# EAGLE design year-led-r1 (EAGLE 6.5.0)
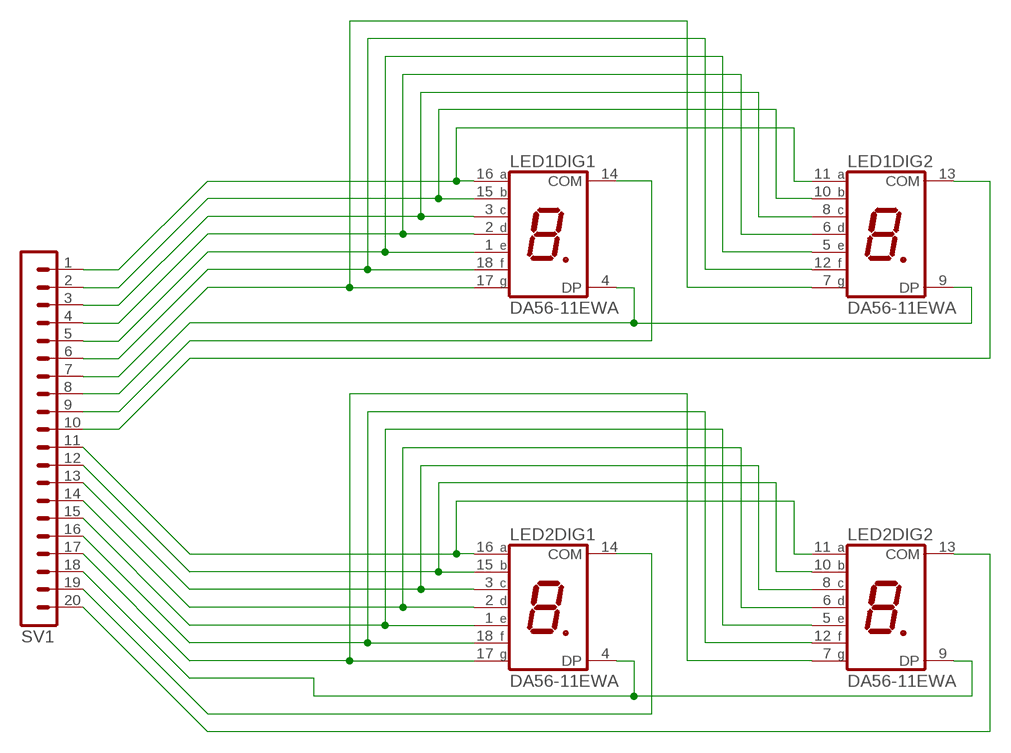
[diagram p0: schematic, sheet 1]

## Parts
LED1  DA56-11EWA  [DA56]
LED2  DA56-11EWA  [DA56]
SV1  MA20-1W  [MA20-1W]

## Nets
N$1: LED1.11(DIG2:A) LED1.16(DIG1:A) SV1.1
N$2: LED1.10(DIG2:B) LED1.15(DIG1:B) SV1.2
N$3: LED1.3(DIG1:C) LED1.8(DIG2:C) SV1.3
N$4: LED1.2(DIG1:D) LED1.6(DIG2:D) SV1.4
N$5: LED1.1(DIG1:E) LED1.5(DIG2:E) SV1.5
N$6: LED1.12(DIG2:F) LED1.18(DIG1:F) SV1.6
N$7: LED1.7(DIG2:G) LED1.17(DIG1:G) SV1.7
N$8: LED1.4(DIG1:DP) LED1.9(DIG2:DP) SV1.8
N$9: LED2.11(DIG2:A) LED2.16(DIG1:A) SV1.11
N$10: LED2.10(DIG2:B) LED2.15(DIG1:B) SV1.12
N$11: LED2.3(DIG1:C) LED2.8(DIG2:C) SV1.13
N$12: LED2.2(DIG1:D) LED2.6(DIG2:D) SV1.14
N$13: LED2.1(DIG1:E) LED2.5(DIG2:E) SV1.15
N$14: LED2.12(DIG2:F) LED2.18(DIG1:F) SV1.16
N$15: LED2.7(DIG2:G) LED2.17(DIG1:G) SV1.17
N$16: LED2.4(DIG1:DP) LED2.9(DIG2:DP) SV1.18
N$17: LED1.13(DIG2:COM) SV1.10
N$20: LED1.14(DIG1:COM) SV1.9
N$26: LED2.14(DIG1:COM) SV1.19
N$27: LED2.13(DIG2:COM) SV1.20

## Library data of the parts
LED1 LED2 = display-kingbright:DA56-11: 14.22mm (0.56INCH) DUAL DIGIT NUMERIC DISPLAYS Source: www.kingbright.com .. DA56-11SRWA.pdf; OC_FARNELL: unknown; OC_NEWARK: unknown
SV1 = con-lstb:MA20-1W: PIN HEADER; OC_FARNELL: unknown; OC_NEWARK: unknown

## Board
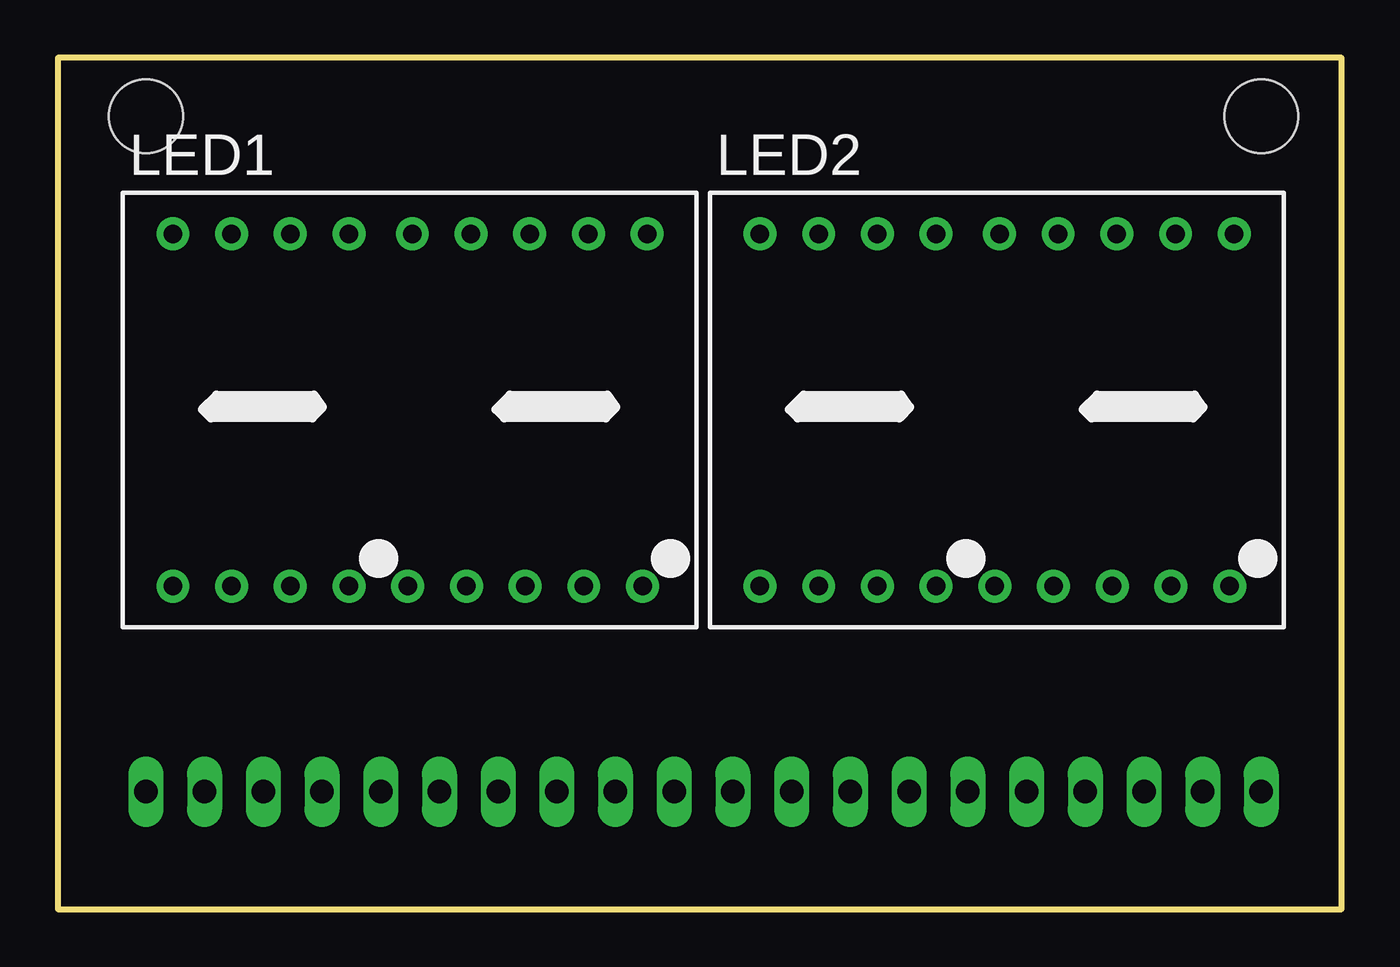
[diagram p1: board, top side]
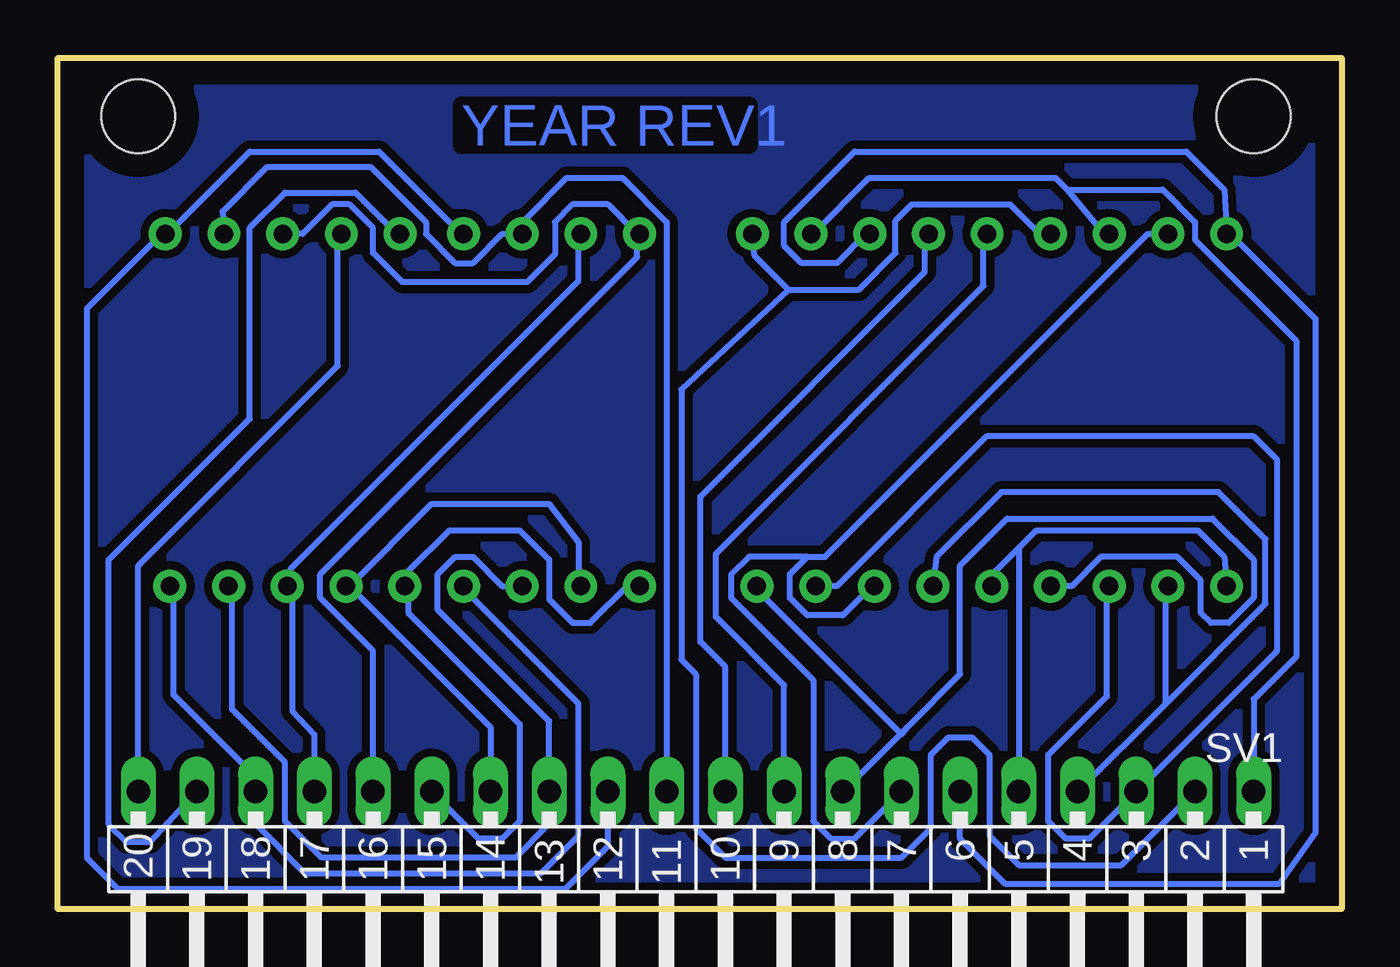
[diagram p2: board, bottom side, seen from below]

Size 55.55 x 36.82 mm. Coordinates in mm from the lower left corner, seen from the top.
Outline: 0,0 55.55,0 55.55,36.82 0,36.82 0,0
Copper layers (1*16): Top 0.035mm / dielectric 1.5mm / Bottom 0.035mm
Design rules "default *": minimum track width 10mil, minimum drill 24mil, track to track 14mil, track to pad 14mil, pad to pad 14mil, via to via 14mil, smd to smd 14mil, copper to edge 40mil, drill to drill 8mil, minimum pad ring 10mil, minimum via ring 8mil, stop-mask expansion 4mil, vias tented up to drill 0mil, thermal gap 10mil
Holes 3.2 mm at 3.81,34.29 52.07,34.29

### Footprints (pad centres in the part's own frame; a part is rotated, then mirrored left to right if it is on the bottom)
DA56 = drill 0.8 pad 1.422: 1 -10.26,-7.62; 2 -7.72,-7.62; 3 -5.18,-7.62; 4 -2.64,-7.62; 5 -0.1,-7.62; 6 2.44,-7.62; 7 4.98,-7.62; 8 7.52,-7.62; 9 10.06,-7.62; 10 10.26,7.62; 11 7.72,7.62; 12 5.18,7.62; 13 2.64,7.62; 14 0.1,7.62; 15 -2.64,7.62; 16 -5.18,7.62; 17 -7.72,7.62; 18 -10.26,7.62
MA20-1W = drill 1.016 long: 1 -24.13,0; 2 -21.59,0; 3 -19.05,0; 4 -16.51,0; 5 -13.97,0; 6 -11.43,0; 7 -8.89,0; 8 -6.35,0; 9 -3.81,0; 10 -1.27,0; 11 1.27,0; 12 3.81,0; 13 6.35,0; 14 8.89,0; 15 11.43,0; 16 13.97,0; 17 16.51,0; 18 19.05,0; 19 21.59,0; 20 24.13,0

### Placement (x,y rotation side)
LED1  15.24,21.59 0 top
LED2  40.64,21.59 0 top
SV1  27.94,5.08 180 bottom

### Tracks (layer width: path | path; a pad name or v marks a point on that pad's centre or on a via)
N$1
  Bottom 0.254: LED1.16 10.29,29.21 11.87,31.11 | 11.87,31.11 12.38,31.62 20.45,31.62 22.86,29.21 LED1.11 | SV1.1 3.81,9.08 1.97,10.92 1.97,24.57 6.35,28.96 6.35,29.72 7.75,31.11 11.87,31.11
N$2
  Bottom 0.254: LED1.15 13.08,29.21 14.35,30.48 18.61,30.48 19.3,29.78 19.3,28.38 20.89,26.8 23.94,26.8 | 23.94,26.8 25.4,28.26 LED1.10 | SV1.2 9.53,1.91 13.97,1.91 15.24,3.17 15.24,6.67 16,7.43 17.02,7.43 17.78,6.67 17.78,3.49 19.05,2.22 26.67,2.22 27.94,3.49 27.94,10.16 28.57,10.79 28.57,22.48 23.94,26.8
N$3
  Bottom 0.254: LED1.3 10.16,13.97 10.16,9.21 12.7,6.67 12.7,3.81 11.94,3.05 10.92,3.05 SV1.3 2.79,11.18 2.79,19.43 3.81,20.45 15.37,20.45 21.84,13.97 LED1.8
N$4
  Bottom 0.254: 7.62,8.89 7.62,13.97 LED1.2 | SV1.4 7.62,8.89 | 7.62,8.89 3.3,13.21 3.3,16 5.33,18.03 14.73,18.03 17.53,15.24 LED1.6
N$5
  Bottom 0.254: 13.97,15.62 14.99,14.61 LED1.5 | 13.97,15.62 13.21,16.38 6.22,16.38 5.08,15.24 LED1.1 | 13.97,15.62 SV1.5
N$6
  Bottom 0.254: LED1.12 20.57,29.21 21.84,27.94 23.37,27.94 24.13,28.7 24.13,29.72 21.08,32.77 6.73,32.77 5.08,31.11 LED1.18 4.83,29.21 1.14,25.53 1.14,3.3 2.73,1.08 14.54,1.08 16.51,3.05 SV1.6
N$7
  Bottom 0.254: LED1.17 8.38,29.21 22.35,15.24 23.11,15.24 | 23.11,15.24 23.88,14.48 23.88,13.46 23.11,12.7 21.59,12.7 20.32,13.97 LED1.7 | SV1.7 21.08,3.05 22.1,3.05 22.86,3.81 22.86,9.91 26.42,13.46 26.42,14.48 25.65,15.24 23.11,15.24
N$8
  Bottom 0.254: LED1.4 11.68,13.97 10.41,15.24 7.11,15.24 6.1,14.22 6.1,12.83 5.65,12.38 4.89,12.38 3.81,13.46 3.81,15.11 5.59,16.89 14.48,16.89 16.51,14.86 16.51,10.16 18.8,7.87 | SV1.8 18.8,7.87 | 18.8,7.87 19.05,7.56 25.15,13.65 LED1.9
N$9
  Bottom 0.254: LED2.11 48.42,30.16 46.48,32.1 42.01,32.1 39.62,29.72 39.62,29.21 38.35,27.94 37.59,27.94 36.32,29.21 LED2.16 35.31,29.84 33.53,31.62 31.11,31.62 29.21,29.72 SV1.11
N$10
  Bottom 0.254: LED2.15 38.1,29.21 41.66,32.77 47.24,32.77 50.8,29.21 LED2.10 51.05,29.21 54.29,25.97 54.29,2.22 52.96,0.89 33.59,0.89 31.75,2.73 SV1.12
N$11
  Bottom 0.254: LED2.3 36.32,13.97 37.59,15.24 38.35,15.24 39.12,14.48 39.12,12.95 34.29,8.13 SV1.13 34.29,3.68 35.75,2.22 44.13,2.22 45.72,3.81 45.72,6.35 48.01,8.64 48.01,13.97 LED2.8
N$12
  Bottom 0.254: 42.93,13.97 39.37,17.53 34.29,17.53 33.02,15.88 33.02,13.97 LED2.2 | SV1.14 36.83,7.87 42.93,13.97 | 42.93,13.97 LED2.6
N$13
  Bottom 0.254: LED2.1 30.92,13.97 32.51,12.38 33.27,12.38 34.29,13.4 34.29,15.11 35.56,16.38 38.61,16.38 40.39,14.61 | SV1.15 37.34,3.05 36.32,3.05 35.56,3.81 35.56,8 40.39,12.83 40.39,14.61 | 40.39,14.61 LED2.5
N$14
  Bottom 0.254: 30.48,29.21 30.48,28.19 44.2,14.48 44.2,13.46 41.91,11.18 SV1.16 | LED2.12 44.96,29.21 43.69,30.48 42.93,30.48 41.91,29.46 41.91,28.38 40.64,27.11 35.24,27.11 34.04,28.32 34.04,29.72 33.27,30.48 31.75,30.48 30.48,29.21 | 30.48,29.21 LED2.18
N$15
  Bottom 0.254: 45.47,13.97 45.47,14.73 33.02,27.18 33.02,29.21 LED2.17 | SV1.17 44.45,7.56 45.4,8.57 45.4,13.97 45.47,13.97 | 45.47,13.97 LED2.7
N$16
  Bottom 0.254: LED2.4 37.85,13.97 37.85,13.72 33.02,8.89 33.02,3.17 34.64,1.56 44.86,1.56 46.99,3.68 SV1.18 46.99,5.71 50.55,9.27 50.55,13.97 LED2.9
N$17
  Bottom 0.254: SV1.10 26.67,10.48 27.75,11.56 27.75,17.84 18.03,27.56 18.03,29.21 LED1.13
N$18
  pour Bottom: 0,36.83 55.88,36.83 55.88,0 0,0
N$20
  Bottom 0.254: SV1.9 24.13,9.68 27.08,12.64 27.08,15.37 15.49,26.96 15.49,29.21 LED1.14
N$26
  Bottom 0.254: SV1.19 51.56,2.89 52.58,2.89 53.34,3.65 53.34,15.11 47.24,21.21 47.24,29.46 45.72,30.99 42.67,30.99 40.89,29.21 LED2.14
N$27
  Bottom 0.254: SV1.20 52.07,14.86 43.43,23.5 43.43,29.21 LED2.13

### Text on the board
Bottom: YEAR REV1